# EasyEDA schematic SCH_anne sch2_2023-06-27.json
TITLE: Sheet_1; REV: 1.0; Date: 2023-05-24; Sheet: 1/1; Drawn By: ziadd; Company: Your Company
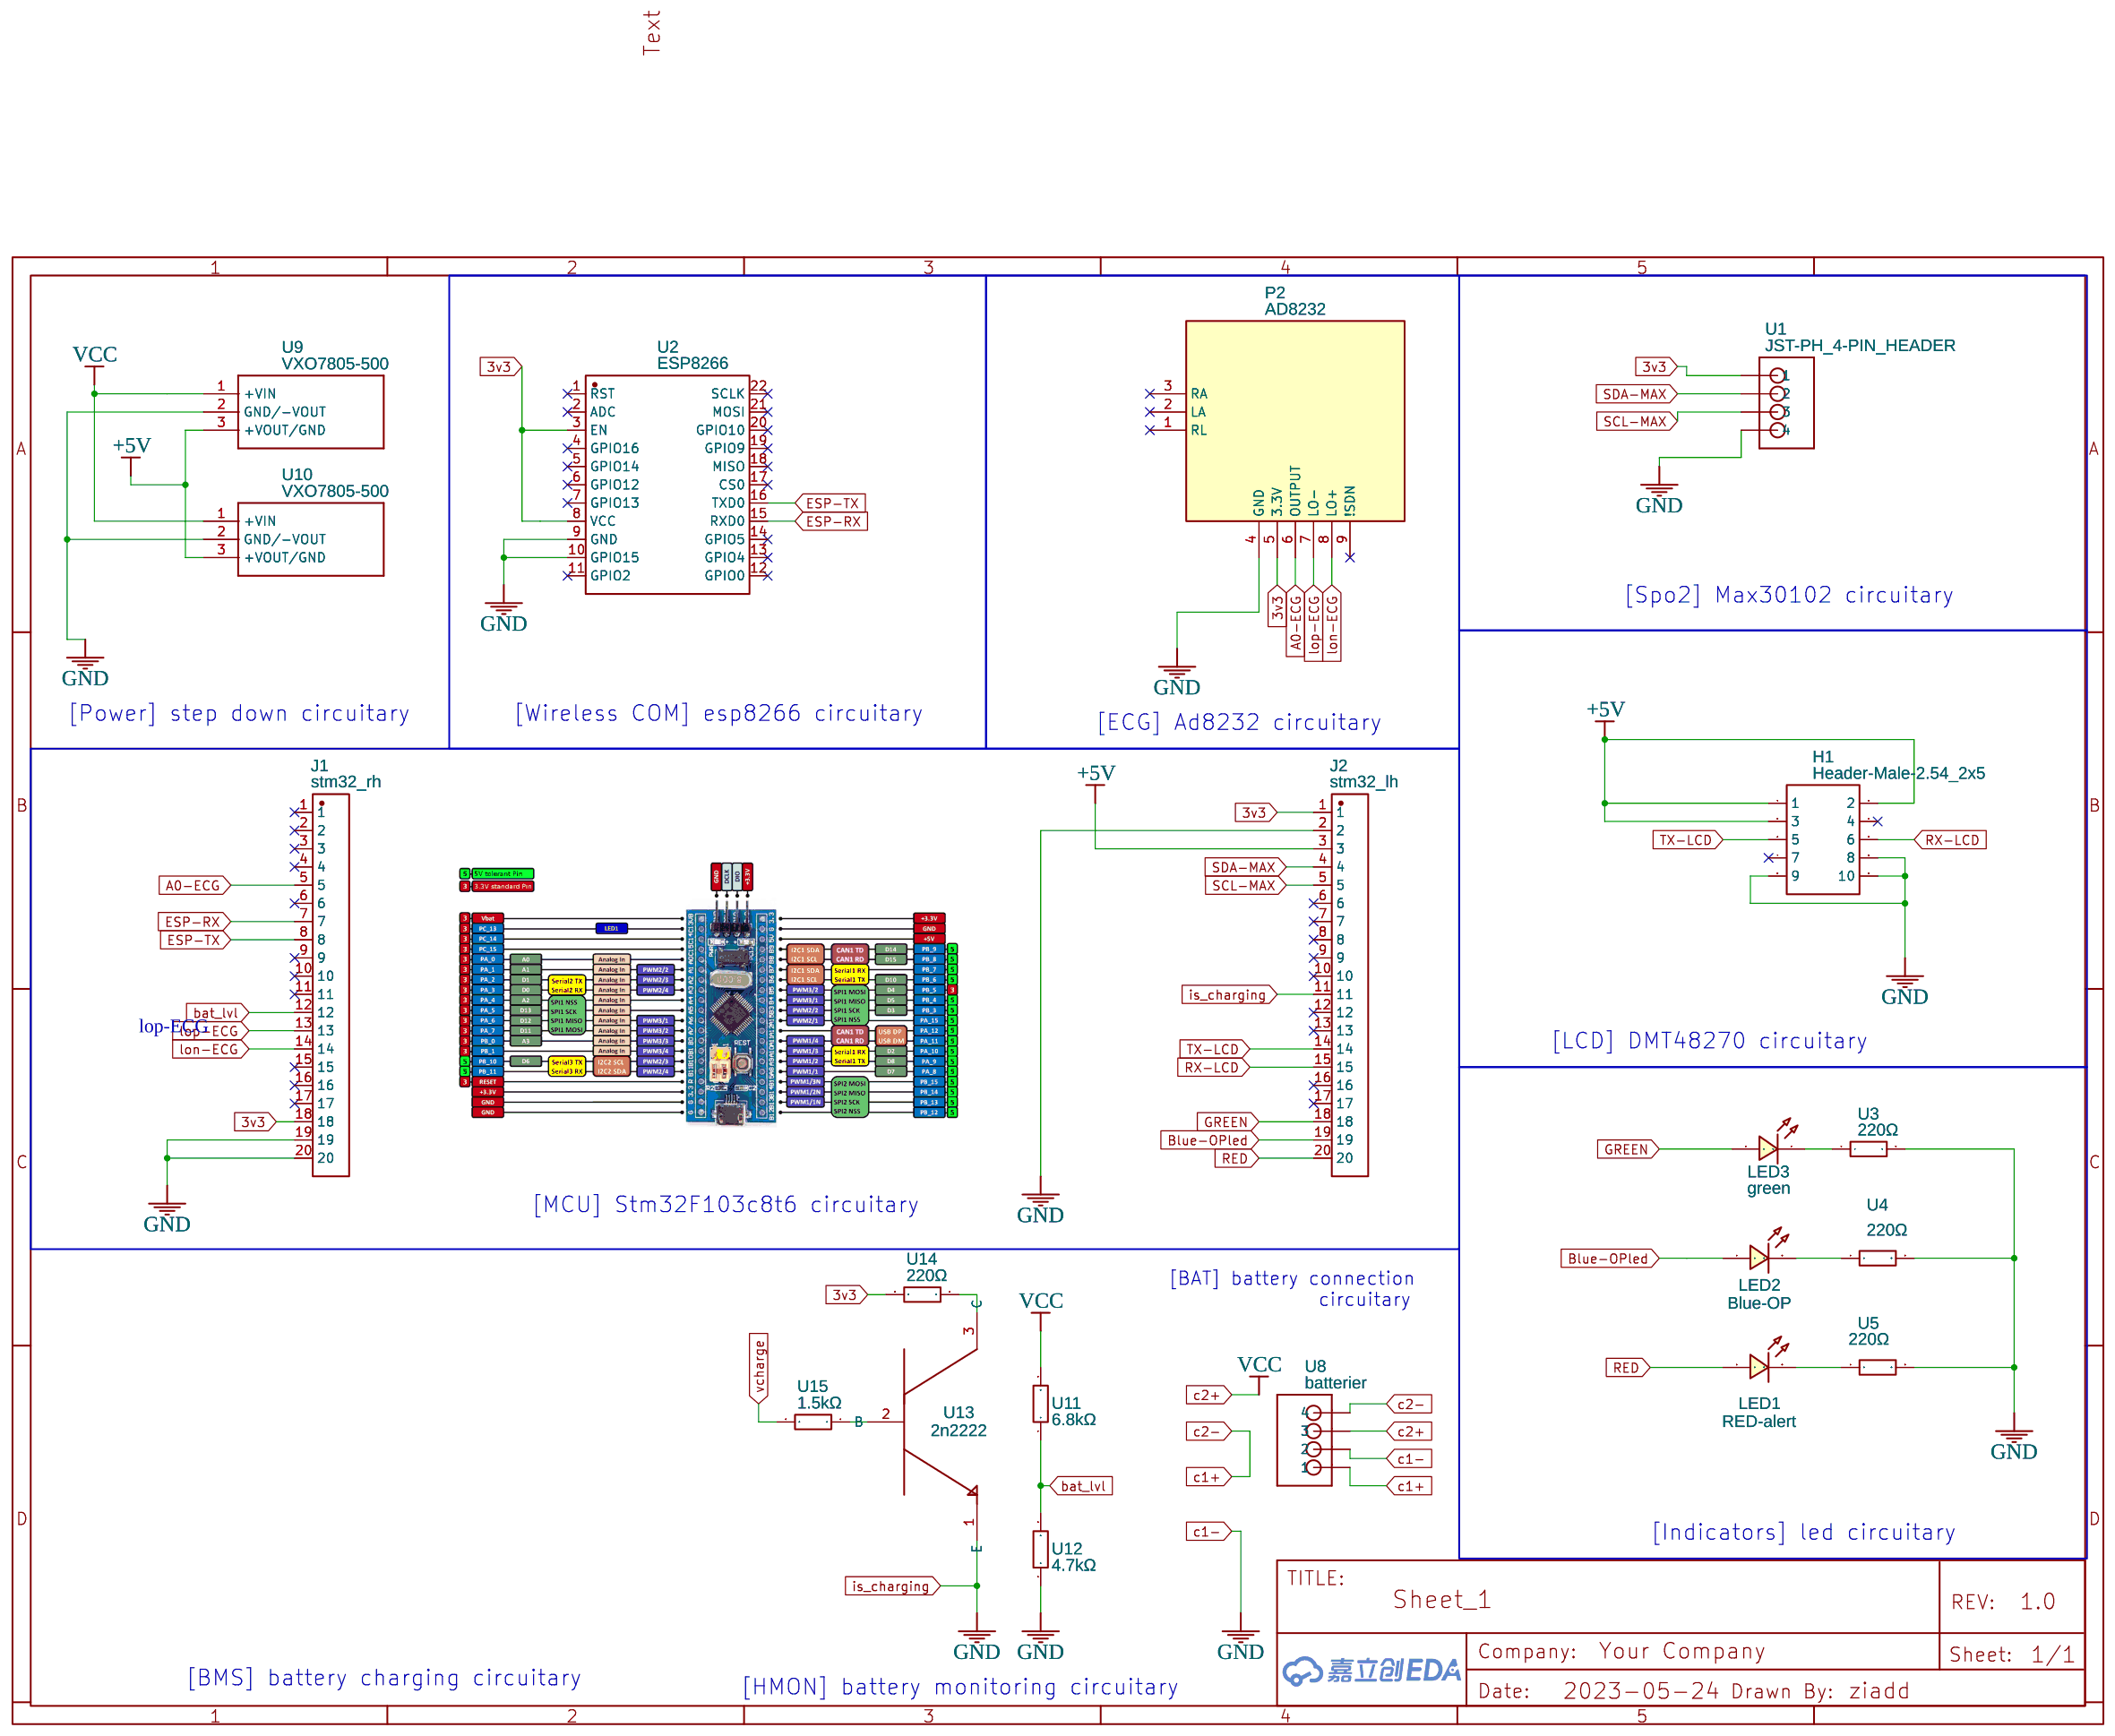
[diagram p0: schematic sheet]

## Parts
H1  Header-Male-2.54_2x5  [HDR-TH_10P-P2.54-V-M-R2-C5-S2.54]
J1  stm32_rh  [HDR-TH_20P-P2.54-V-M-1]
J2  stm32_lh  [HDR-TH_20P-P2.54-V-M-1]
LED1  RED-alert  [LED0603_RED]
LED2  Blue-OP  [LED0603_RED]
LED3  green  [LED0603_RED]
P2  AD8232  [AD8232]
U1  JST-PH_4-PIN_HEADER  [JST_B4B-PH_HEADER]
U2  ESP8266  [WIFIM-SMD_ESP-12F-ESP8266MOD]
U3  220Ω  [RES-TH_BD2.7-L6.2-P10.20-D0.4]
U4  220Ω  [RES-TH_BD2.7-L6.2-P10.20-D0.4]
U5  220Ω  [RES-TH_BD2.7-L6.2-P10.20-D0.4]
U8  batterier  [JST_B4B-PH_HEADER]
U9  VXO7805-500  [VXO7805-500]
U10  VXO7805-500  [VXO7805-500]
U11  6.8kΩ  [RES-TH_BD2.7-L6.2-P10.20-D0.4]
U12  4.7kΩ  [RES-TH_BD2.7-L6.2-P10.20-D0.4]
U13  2n2222  [2N2222]
U14  220Ω  [RES-TH_BD2.7-L6.2-P10.20-D0.4]
U15  1.5kΩ  [RES-TH_BD2.7-L6.2-P10.20-D0.4]

## Library data of the parts
H1 = Header-Male-2.54_2x5: Supplier: LCSC; Manufacturer Part: 2*5pHeaders  Pins 2.54mm; Supplier Part: C28207; JLCPCB Part Class: Extended Part
J1 J2 = Header-Male-2.54_1x20: Supplier: LCSC; Manufacturer: BOOMELE(博穆精密); Manufacturer Part: 2.54-1*20P直针; Supplier Part: C50981; JLCPCB Part Class: Extended Part
LED1-LED3 = LED-0603_R: Manufacturer: EVERLIGHT(台湾亿光); Manufacturer Part: 19-217/R6C-AL1M2VY/3T; Supplier Part: C72044; Supplier: LCSC; Contributor: LCEDA_01
P2 = AD8232: sourceId: 96QK2WNHZ; Supplier Part: 12587; Supplier: SparkFun
U1 U8 = JST-PH_4-PIN_HEADER
U2 = ESP8266: Supplier: LCSC; Supplier Part: C9900003049; Manufacturer: null; JLCPCB Part Class: Extended Part; LINK: https://img.jlc.com/image//data/smt-stock-produce/componentSizePhoto/2021-12-02/b5eb61357b2a478295008aee8c894ebd/BG2111290693_D21112900056_font.png; Contributor: LCSC
U3-U5 U11 U12 U14 U15 = CR1/4W-2K7±5%-ST26: Supplier: LCSC; Supplier Part: C2894624; Manufacturer: VO(翔胜); link: https://atta.szlcsc.com/upload/public/pdf/source/20210803/C2857407_45FF53FE186CAB545115AD37303966CD.pdf; Contributor: lcsc; JLCPCB Part Class: Extended Part
U9 U10 = VXO7805-500: Contributor: alecamar
U13 = 2n2222: Supplier: Digi-Key; Contributor: tlacuache

## Nets
3v3: J1.18 J2.1 P2.5(3.3V) U1.P1(1) U2.3(EN) U2.8(VCC) U14.2
+5V: H1.1 H1.2 H1.3 J2.3 U9.3(+VOUT/GND) U10.3(+VOUT/GND)
GND: H1.8 H1.9 H1.10 J1.19 J1.20 J2.2 J2.11 P2.4(GND) U1.P4(4) U2.9(GND) U2.10(GPIO15) U3.2 U4.2 U5.2 U8.P2(2) U9.2(GND/-VOUT) U10.2(GND/-VOUT) U12.1
VCC: U8.P3(3) U9.1(+VIN) U10.1(+VIN) U11.2
A0-ECG: J1.5 P2.6(OUTPUT)
bat_lvl: J1.12 U11.1 U12.2
Blue-OPled: J2.19 LED2.1
c1+: U8.P1(1) U8.P4(4)
ESP-RX: J1.7 U2.15(RXD0)
ESP-TX: J1.8 U2.16(TXD0)
GREEN: J2.18 LED3.1
lon-ECG: J1.14 P2.8(LO+)
lop-ECG: J1.13 P2.7(LO-)
RED: J2.20 LED1.1
RX-LCD: H1.6 J2.15
SCL-MAX: J2.5 U1.P3(3)
SDA-MAX: J2.4 U1.P2(2)
TX-LCD: H1.5 J2.14
vcharge: U15.2
Net-(LED1-2): LED1.2 U5.1
Net-(LED2-2): LED2.2 U4.1
Net-(LED3-2): LED3.2 U3.1

Not connected (* = marked no-connect by the designer): H1 4* 7*; J1 1* 2* 3* 4* 6* 9* 10* 11* 15* 16* 17*; J2 6* 7* 8* 9* 10* 12* 13* 16* 17*; P2 1(RL)* 2(LA)* 3(RA)* 9(!SDN)*; U2 1(RST)* 2(ADC)* 4(GPIO16)* 5(GPIO14)* 6(GPIO12)* 7(GPIO13)* 11(GPIO2)* 12(GPIO0)* 13(GPIO4)* 14(GPIO5)* 17(CS0)* 18(MISO)* 19(GPIO9)* 20(GPIO10)* 21(MOSI)* 22(SCLK)*; U13 1(E) 2(B) 3(C); U14 1; U15 1

## Notes on the sheet
- [Spo2] Max30102 circuitary
- [Power] step down circuitary
- [Wireless COM] esp8266 circuitary
- [ECG] Ad8232 circuitary
- lop-ECG
- [LCD] DMT48270 circuitary
- [MCU] Stm32F103c8t6 circuitary
- [BAT] battery connection
                 circuitary
- [Indicators] led circuitary
- [BMS] battery charging circuitary
- [HMON] battery monitoring circuitary
